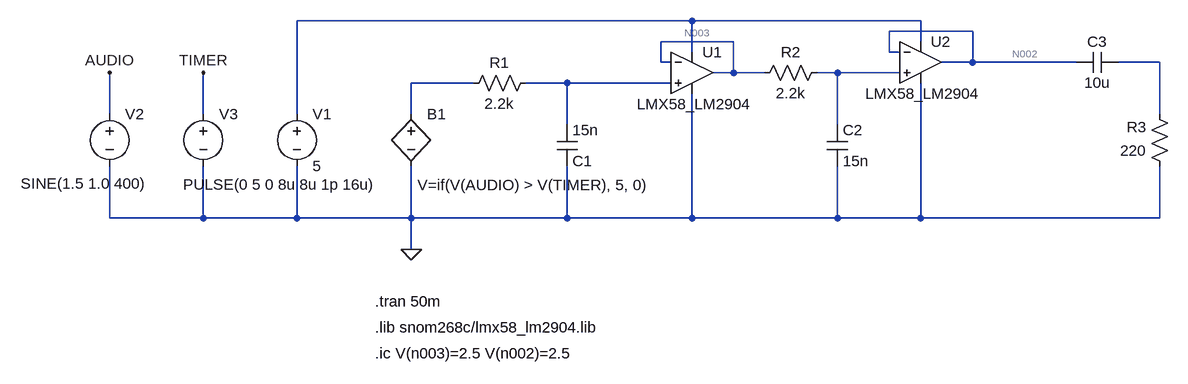
[diagram p0: schematic audio_output_stage.asc]
audio_output_stage.asc, the LTspice schematic file:
Version 4.1
SHEET 1 1344 732
WIRE 544 64 -64 64
WIRE 896 64 544 64
WIRE 976 80 848 80
WIRE 608 96 496 96
WIRE 896 96 896 64
WIRE 544 112 544 64
WIRE 848 112 848 80
WIRE 864 112 848 112
WIRE 496 128 496 96
WIRE 512 128 496 128
WIRE 976 128 976 80
WIRE 976 128 928 128
WIRE 1136 128 976 128
WIRE 1264 128 1200 128
WIRE 608 144 608 96
WIRE 608 144 576 144
WIRE 656 144 608 144
WIRE 768 144 736 144
WIRE 864 144 768 144
WIRE 208 160 112 160
WIRE 352 160 288 160
WIRE 512 160 352 160
WIRE -352 208 -352 144
WIRE -208 208 -208 144
WIRE -64 208 -64 64
WIRE 112 208 112 160
WIRE 1264 208 1264 128
WIRE 352 224 352 160
WIRE 768 224 768 144
WIRE -352 368 -352 288
WIRE -208 368 -208 288
WIRE -208 368 -352 368
WIRE -64 368 -64 288
WIRE -64 368 -208 368
WIRE 112 368 112 288
WIRE 112 368 -64 368
WIRE 352 368 352 288
WIRE 352 368 112 368
WIRE 544 368 544 176
WIRE 544 368 352 368
WIRE 768 368 768 288
WIRE 768 368 544 368
WIRE 896 368 896 160
WIRE 896 368 768 368
WIRE 1264 368 1264 288
WIRE 1264 368 896 368
WIRE 112 416 112 368
FLAG 112 416 0
FLAG -352 144 AUDIO
FLAG -208 144 TIMER
SYMBOL voltage -352 192 R0
WINDOW 123 0 0 Left 0
WINDOW 39 0 0 Left 0
WINDOW 3 -137 123 Left 2
SYMATTR Value SINE(1.5 1.0 400)
SYMATTR InstName V2
SYMBOL voltage -64 192 R0
WINDOW 123 0 0 Left 0
WINDOW 39 0 0 Left 0
SYMATTR InstName V1
SYMATTR Value 5
SYMBOL res 304 144 R90
WINDOW 0 0 56 VBottom 2
WINDOW 3 32 56 VTop 2
SYMATTR InstName R1
SYMATTR Value 2.2k
SYMBOL cap 336 224 R0
WINDOW 0 24 56 Left 2
WINDOW 3 24 8 Left 2
SYMATTR InstName C1
SYMATTR Value 15n
SYMBOL cap 752 224 R0
SYMATTR InstName C2
SYMATTR Value 15n
SYMBOL res 752 128 R90
WINDOW 0 0 56 VBottom 2
WINDOW 3 32 56 VTop 2
SYMATTR InstName R2
SYMATTR Value 2.2k
SYMBOL OpAmps\\opamp2 544 80 R0
WINDOW 3 -85 112 Left 2
SYMATTR Value LMX58_LM2904
SYMATTR InstName U1
SYMBOL voltage -208 192 R0
WINDOW 3 -31 124 Left 2
WINDOW 123 0 0 Left 0
WINDOW 39 0 0 Left 0
SYMATTR Value PULSE(0 5 0 8u 8u 1p 16u)
SYMATTR InstName V3
SYMBOL bv 112 192 R0
WINDOW 3 10 125 Left 2
SYMATTR Value V=if(V(AUDIO) > V(TIMER), 5, 0)
SYMATTR InstName B1
SYMBOL OpAmps\\opamp2 896 64 R0
WINDOW 3 -85 112 Left 2
SYMATTR Value LMX58_LM2904
SYMATTR InstName U2
SYMBOL res 1280 304 R180
WINDOW 0 36 76 Left 2
WINDOW 3 36 40 Left 2
SYMATTR InstName R3
SYMATTR Value 220
SYMBOL cap 1200 112 R90
WINDOW 0 0 32 VBottom 2
WINDOW 3 32 32 VTop 2
SYMATTR InstName C3
SYMATTR Value 10u
TEXT 56 496 Left 2 !.tran 50m
TEXT 56 536 Left 2 !.lib snom268c/lmx58_lm2904.lib
TEXT 56 576 Left 2 !.ic V(n003)=2.5 V(n002)=2.5

The netlist it stands for:
* audio_output_stage.asc
V2 AUDIO 0 SINE(1.5 1.0 400)
V1 N001 0 5
R1 N007 N006 2.2k
C1 N007 0 15n
C2 N005 0 15n
R2 N005 N003 2.2k
X§U1 N007 N003 N001 0 N003 LMX58_LM2904  ; pins In+ In- V+ V- OUT
V3 TIMER 0 PULSE(0 5 0 8u 8u 1p 16u)
B1 N006 0 V=if(V(AUDIO) > V(TIMER), 5, 0)
X§U2 N005 N002 N001 0 N002 LMX58_LM2904  ; pins In+ In- V+ V- OUT
R3 0 N004 220
C3 N004 N002 10u
.tran 50m
.lib snom268c/lmx58_lm2904.lib
.ic V(n003)=2.5 V(n002)=2.5
.backanno
.end